# Altium project LG6.PrjPCB
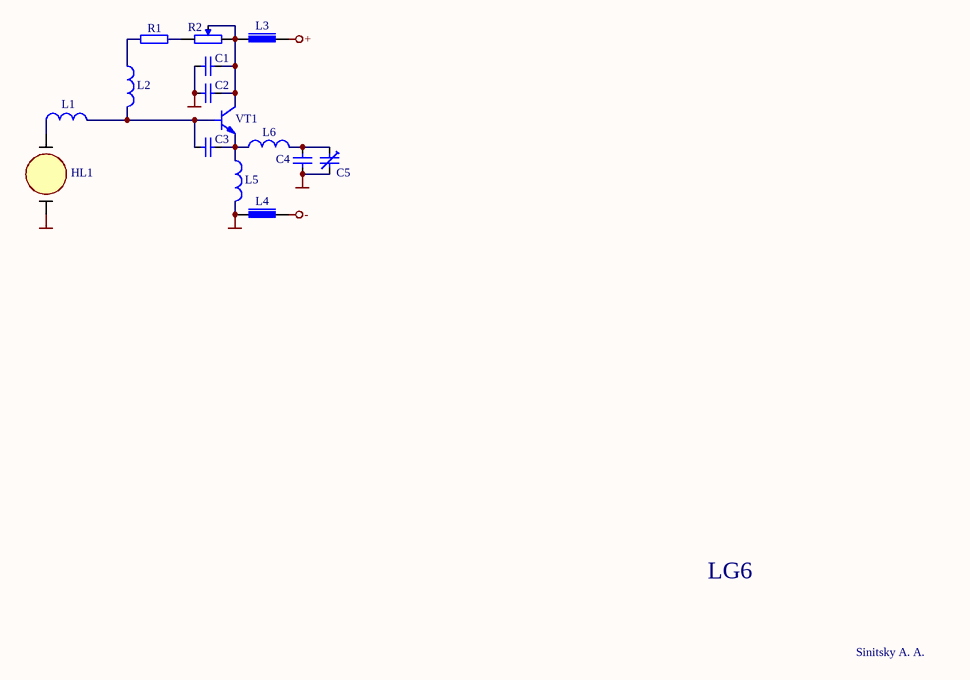
[diagram p0: LG6.SchDoc]
1 sheet, 15 parts. Net scope: global (net labels, ports and power ports of the same name join across sheets).
Board file: LG6.PcbDoc

## Sheet LG6.SchDoc
size A4; DrawnBy: Sinitsky A. A.

### Parts
C1  CER  [C_0805_0.9]  (value not drawn)
C2  CER  [C_0805_0.6]  (value not drawn)
C3  CER  [C_0805_0.6]  (value not drawn)
C4  CER  [C_0805_0.6]  (value not drawn)
C5  C_Trimmer  [TZB4-B]  (value not drawn)
HL1  CE_Lamp  (value not drawn)
L1  Inductor_1  (value not drawn)
L2  Inductor_1  [L_1210_2]  (value not drawn)
L3  EMI_Suppressor  [L_1206_1.25]  (value not drawn)
L4  EMI_Suppressor  [L_1206_1.25]  (value not drawn)
L5  Inductor_1  [L_1210_2]  (value not drawn)
L6  Inductor_1  [L_1210_2]  (value not drawn)
R1  Resistor  [R_0805]  (value not drawn)
R2  R_Variable  [RJ50]  (value not drawn)
VT1  1_NPN_SOT89  [SOT-89]  (value not drawn)

### Nets
+: L3.2
-: L4.2
GND: C1.1 C2.1 C4.1 C5.1 HL1.2 L4.1 L5.2
NetC1_2: C1.2 C2.2 L3.1 R2.1 R2.2 VT1.2(C)
NetC3_1: C3.1 L1.2 L2.2 VT1.1(B)
NetC3_2: C3.2 L5.1 L6.1 VT1.3(E)
NetC4_2: C4.2 C5.2 L6.2
NetHL1_1: HL1.1 L1.1
NetL2_1: L2.1 R1.2
NetR1_1: R1.1 R2.3

### Notes on the sheet
- LG6
- Sinitsky A. A.

### Library data of the parts
C1-C4 = C_Ceramic: Capacitor
C5 = C_Trimmer: Capacitor
HL1 = CE_Lamp: Capacitive Excitation Gas Discharge Lamp
L1 L2 L5 L6 = Inductor_1: Coreless Inductor
L3 L4 = EMI_Suppressor: Inductive EMI Suppressor
R1 = Resistor: Constant; Value: *
R2 = R_Variable: Resistor